# EasyEDA Pro project PowerManager.eprj

# Schematic Schematic1
Create Date: 2024-06-30; Page Name: P1; Project Name: PowerManager; Schematic Name: Schematic1; Update Date: 2024-07-01; Company: 嘉立创EDA; Page Size: A4; Version: V1.0
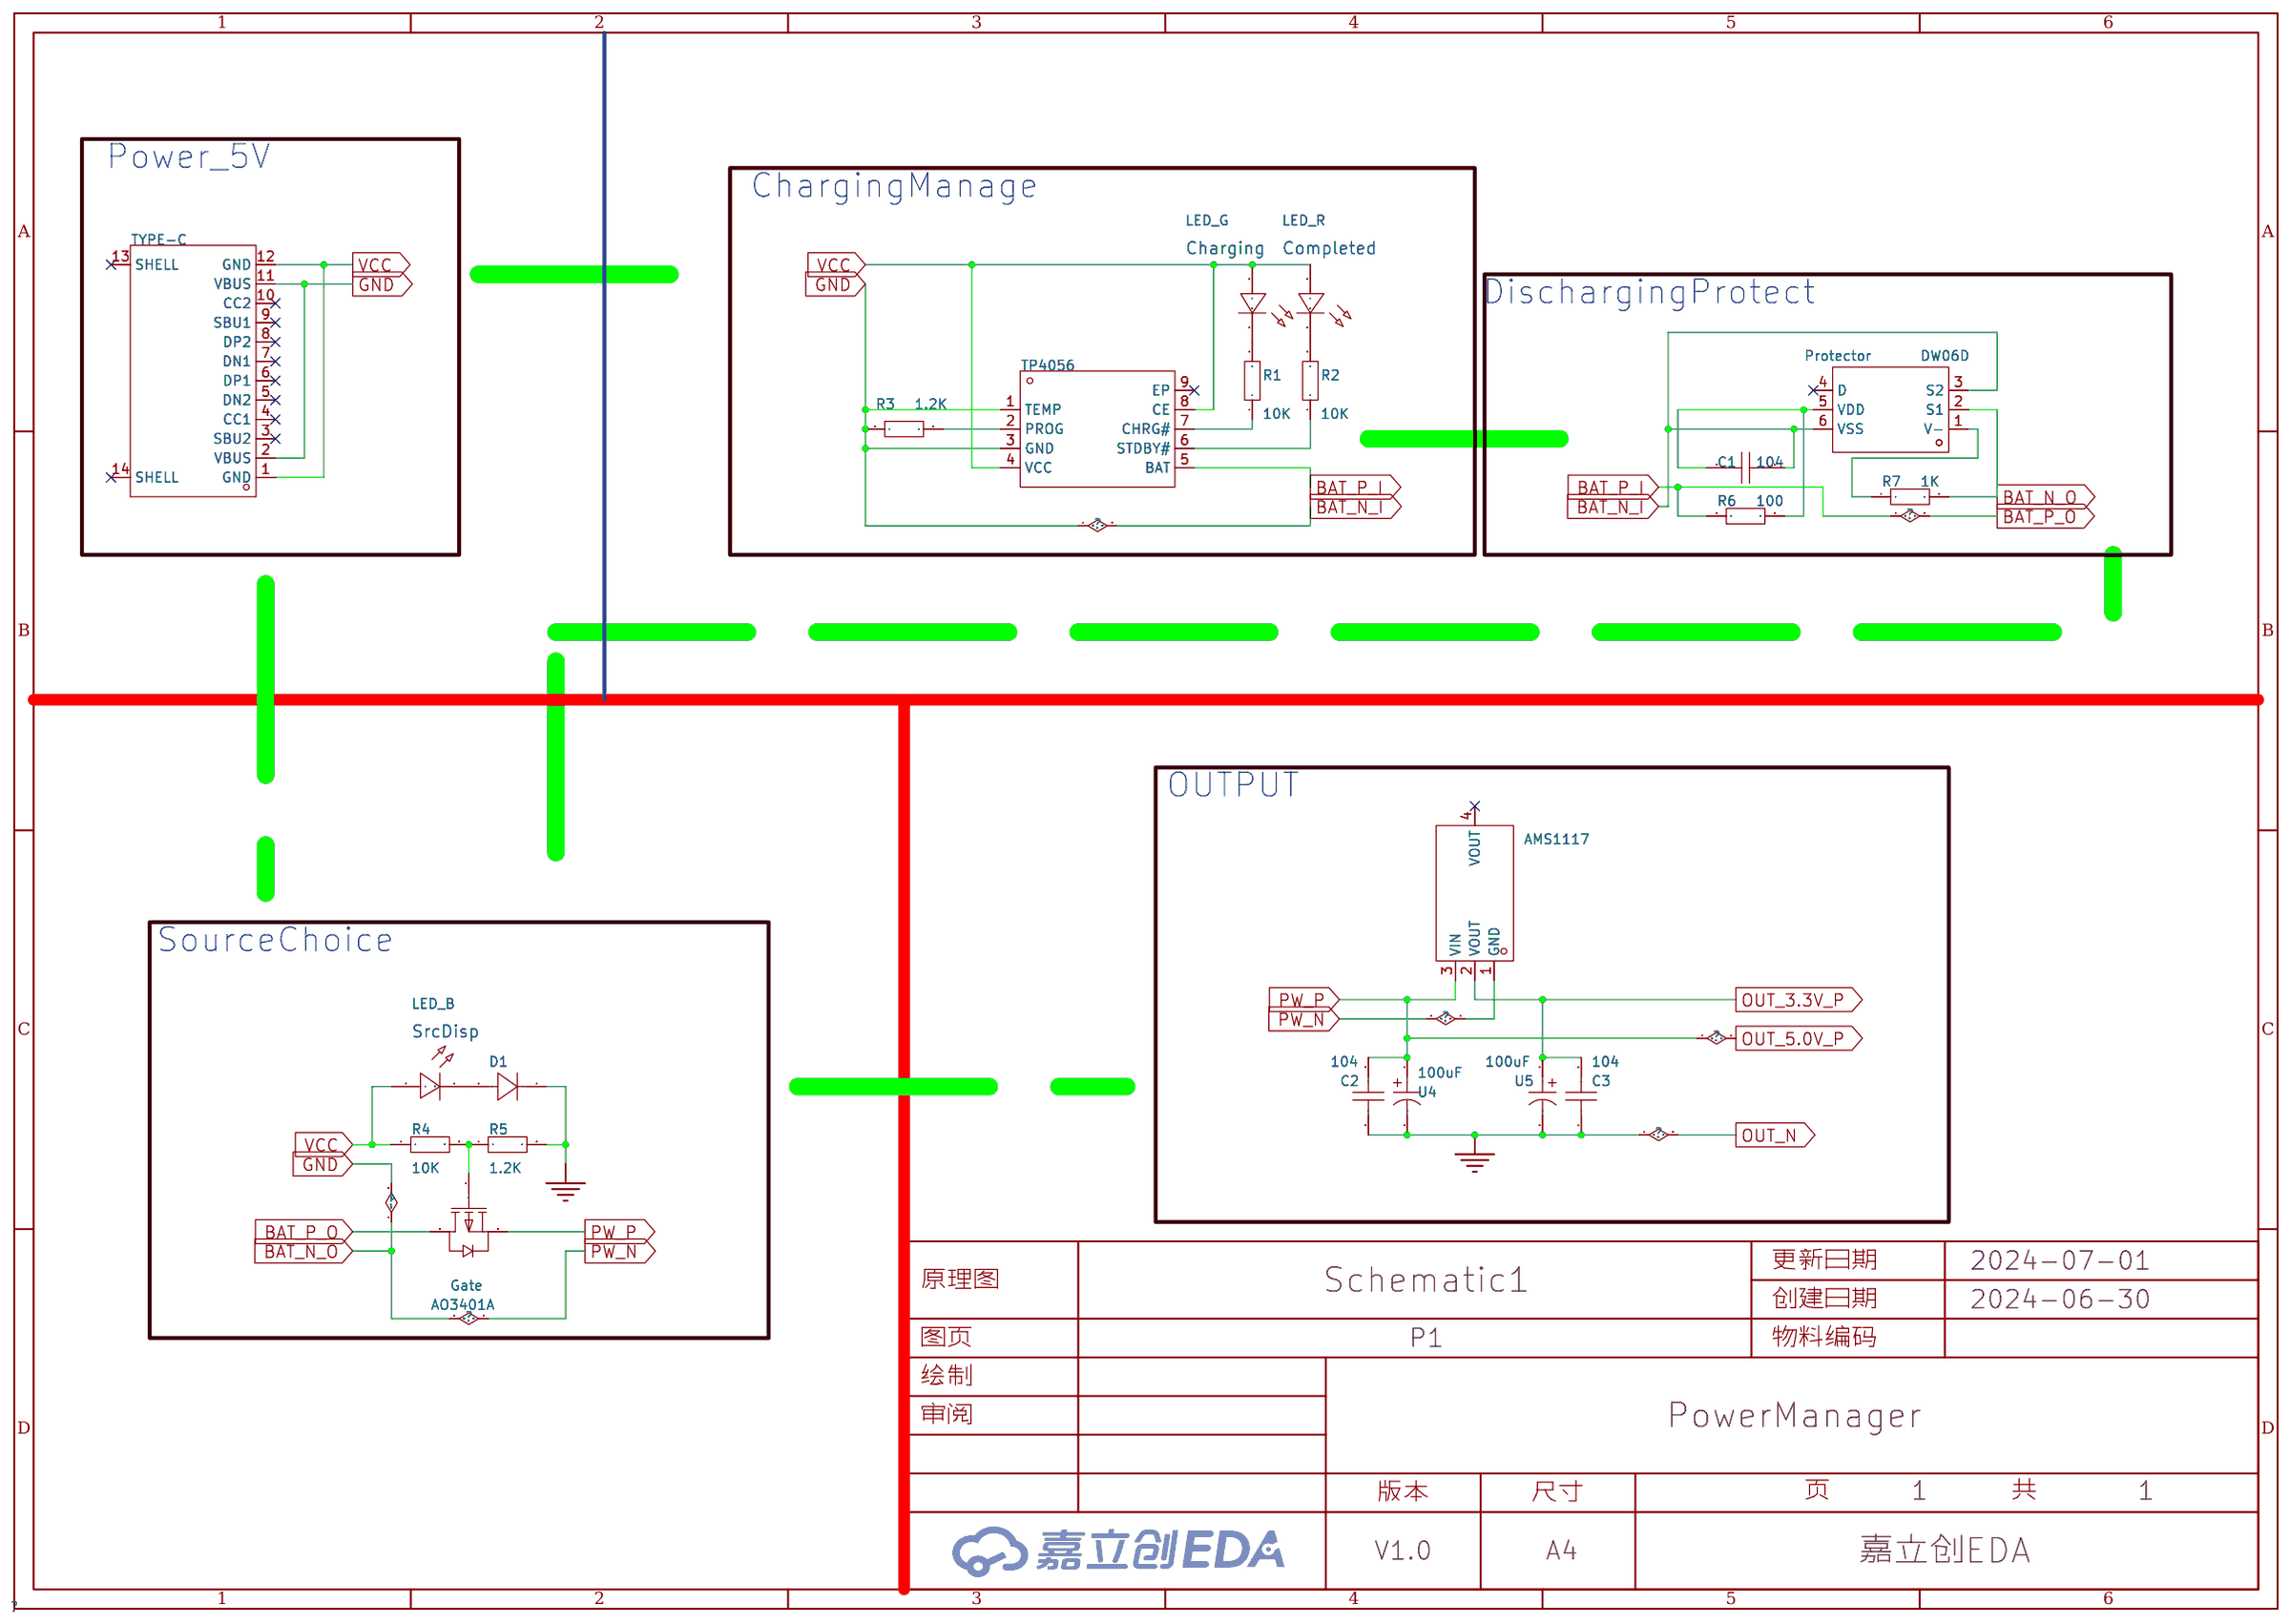
[diagram p0: schematic sheet]

## Parts
C1  104  [C0603]
C2  104  [C0603]
C3  104  [C0603]
Charging  LED_G  [LED_0603]
Completed  LED_R  [LED_0603]
D1  -  [SMA_1N4007]
Gate  AO3401A  [SOT-23_L2.9-W1.3-P1.90-LS2.4-BR]
Protector  DW06D  [SOT-23-6_L2.9-W1.6-P0.95-LS2.8-BR]
R1  10K  [R0603]
R2  10K  [R0603]
R3  1.2K  [R0603]
R4  10K  [R0603]
R5  1.2K  [R0603]
R6  100  [R0603]
R7  1K  [R0603]
SrcDisp  LED_B  [LED_0603]
Type-C  TYPE-C  [USB-C-SMD_TYPE-C-6PIN-2MD-073]
U1  TP4056  [ESOP-8_L4.9-W3.9-P1.27-LS6.0-BL-EP]
U3  AMS1117  [SOT-223-3_L6.5-W3.4-P2.30-LS7.0-BR]
U4  100uF  [CAP-SMD_L7.3-W4.3-L-FD_EEFSX0E471E4]
U5  100uF  [CAP-SMD_L7.3-W4.3-L-FD_EEFSX0E471E4]

## Library data of the parts
C1-C3 = CAP_0603: Supplier Footprint: 0603
Charging Completed SrcDisp = LED_0603-R: Supplier Footprint: 0603
D1 = D_1N4007: Supplier Footprint: SMA
Gate = AO3401A_C15127: 类型:1个P沟道;漏源电压(Vdss):30V;连续漏极电流(Id):4A;功率(Pd):1.4W;导通电阻(RDS(on)@Vgs,Id):44mΩ@10V,4.3A;阈值电压(Vgs(th)@Id):1.3V@250uA;; LCSC Part Name: 1个P沟道 耐压:30V 电流:4A; Supplier Part: C15127; Manufacturer: AOS; Supplier Footprint: SOT-23; Datasheet: https://atta.szlcsc.com/upload/public/pdf/source/20160507/1462613609053.pdf; Supplier: LCSC; Type: 1个P沟道; Drain Source Voltage (Vdss): 30V; Continuous Drain Current (Id): 4A; Power Dissipation (Pd): 1.4W; Drain Source On Resistance (RDS(on)@Vgs,Id): 44mΩ@10V,4.3A; Gate Threshold Voltage (Vgs(th)@Id): 1.3V@250uA; Total Gate Charge (Qg@Vgs): 12.2nC@4.5V; Input Capacitance (Ciss@Vds): 1.2nF@15V; Operating Temperature: -55℃~+150℃@(Tj)
Protector = DW06D/J: 二合一锂电池保护 IC; Supplier Part: C82123; Manufacturer: FM(富满); Supplier Footprint: SOT-23-6; Datasheet: https://atta.szlcsc.com/upload/public/pdf/source/20160903/1472896624271.pdf; Supplier: LCSC
R1-R7 = Res_0603: Supplier Footprint: 0603
Type-C = TYPE-C 16PIN 2MD(073): 连接器类型:Type-C;标准:-;公母:母;端口数量:1;触点数量:16P;安装方式:卧贴;额定电流 - 电源:5A;工作温度范围:-25℃~+85℃;; LCSC Part Name: Type-C 母 卧贴; Supplier Part: C2765186; Manufacturer: SHOU HAN(首韩); Supplier Footprint: SMD; Datasheet: https://atta.szlcsc.com/upload/public/pdf/source/20211123/39B17C16241EAC15C5E277BDA434118E.pdf; Supplier: LCSC; Gender: 母; Number of Ports: 1; Number of Contacts: 16P; Mounting Style: 卧贴; Current Rating - Power (Max): 5A; Operating Temperature Range: -25℃~+85℃
U1 = TP4056_C725790: Supplier Part: C725790; Manufacturer: UMW(友台半导体); Supplier Footprint: ESOP-8; Datasheet: https://atta.szlcsc.com/upload/public/pdf/source/20231109/CF74897CE79A500F7FE27A45ADCCC631.pdf; Supplier: LCSC
U3 = AMS1117-3.3_C6186: 输出类型:固定;最大输入电压:-;输出电压:3.3V;最大输出电流:1A;电源纹波抑制比(PSRR):72dB@(120Hz);输出极性:正极;; LCSC Part Name: 输出3.3V 1A; Supplier Part: C6186; Manufacturer: AMS; Supplier Footprint: SOT-223; Datasheet: https://atta.szlcsc.com/upload/public/pdf/source/20180727/C6186_7A095716F0823C02F1997A905E26C086.pdf; Supplier: LCSC; Output Type: 固定; Output Voltage: 3.3V; MAX Output Current: 1A; Power Supply Rejection Ratio (PSRR): 72dB@(120Hz); Dropout Voltage: 1.3V@(800mA); Output Polarity: 正极; Number of Outputs: 1
U4 U5 = TR3D107K016C0150: 容值:100uF;精度:±10%;额定电压:16V;等效串联电阻:150mΩ;; LCSC Part Name: 100uF ±10% 16V; Supplier Part: C1953348; Manufacturer: VISHAY(威世); Supplier Footprint: CASE-D-7343-31(mm); Datasheet: https://atta.szlcsc.com/upload/public/pdf/source/20210424/D2589FD6E35F2EE55A4FE29C9A2BF604.pdf; Supplier: LCSC; Tolerance: ±10%; Rated Voltage: 16V; Equivalent Series Resistance(ESR): 150mΩ; Operating Temperature: -55℃~+125℃

## Nets
GND: C1.1 C2.1 C3.1 D1.1(K) Protector.2(S1) Protector.3(S2) Protector.6(VSS) R3.1 R5.2 R7.2 Type-C.2(VBUS) Type-C.11(VBUS) U1.1(TEMP) U1.3(GND) U3.1(GND) U4.2 U5.2
VCC: Charging.2(A) Completed.2(A) R4.1 SrcDisp.2(A) Type-C.1(GND) Type-C.12(GND) U1.4(VCC) U1.8(CE)
BAT_P_I: Gate.3(D) R6.1 U1.5(BAT)
OUT_3.3V_P: C3.2 U3.2(VOUT) U5.1
OUT_5.0V_P: C2.2 Gate.2(S) U3.3(VIN) U4.1
$1N897: Completed.1(C) R2.2
$1N964: Charging.1(C) R1.2
$1N1874: Gate.1(G) R4.2 R5.1
$1N6420: D1.2(A) SrcDisp.1(C)
Net-(C1-2): C1.2 Protector.5(VDD) R6.2
Net-(Protector-1): Protector.1(V-) R7.1
Net-(R1-1): R1.1 U1.7(CHRG#)
Net-(R2-1): R2.1 U1.6(STDBY#)
Net-(R3-2): R3.2 U1.2(PROG)

Not connected (* = marked no-connect by the designer): Protector 4(D)*; Type-C 3(SBU2)* 4(CC1)* 5(DN2)* 6(DP1)* 7(DN1)* 8(DP2)* 9(SBU1)* 10(CC2)* 13(SHELL)* 14(SHELL)*; U1 9(EP)*; U3 4(VOUT)*

## Notes on the sheet
- Power_5V
- ChargingManage
- DischargingProtect
- OUTPUT
- SourceChoice

# Board PCB1
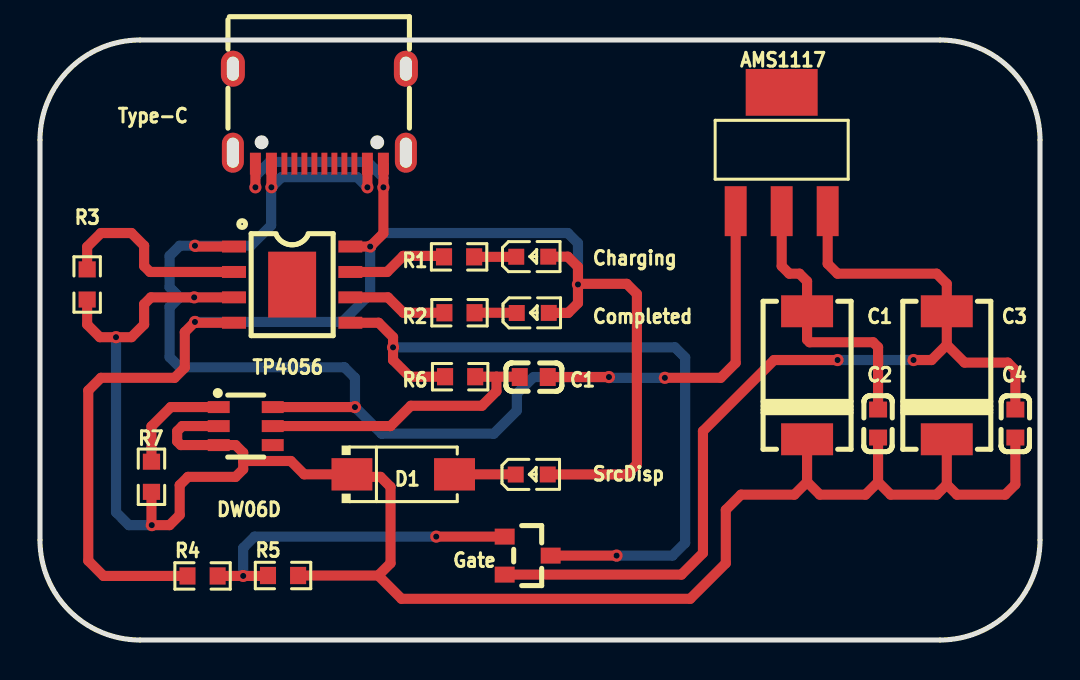
[diagram p1: board, top side]
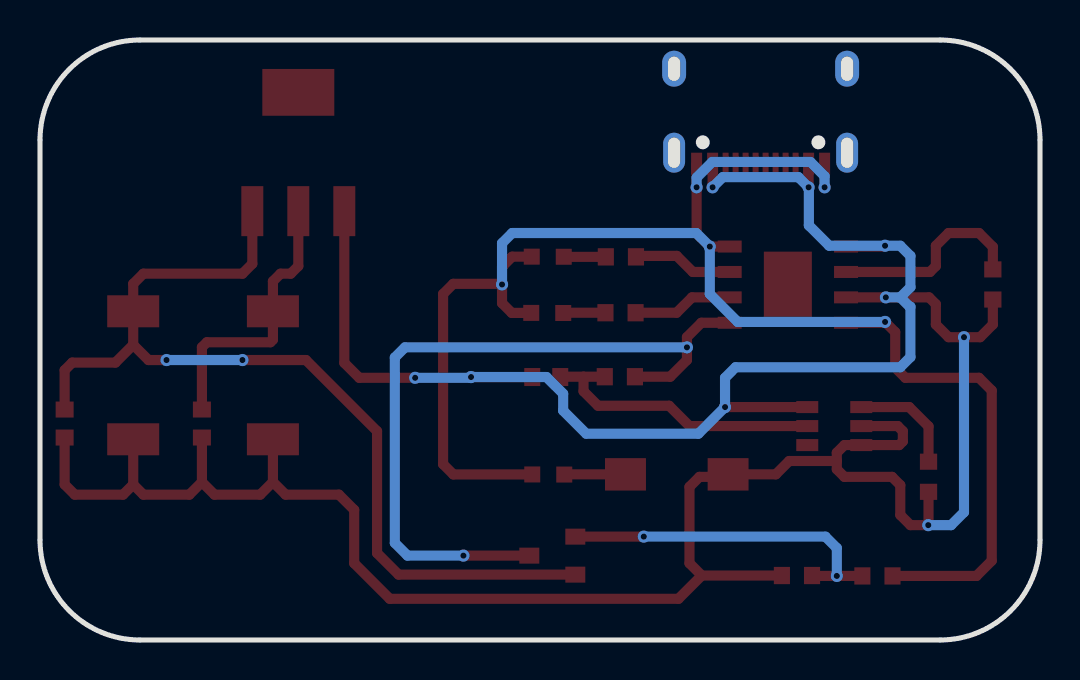
[diagram p2: board, bottom side, seen from below]

Outline 50 x 30 mm; copper layers: Top Layer, Bottom Layer. Coordinates in mm from the lower left corner of the outline.
Outline path: 0,25 0,5 arc(1.46,1.46) 5,0 45,0 arc(48.54,1.46) 50,5 50,25 arc(48.54,28.54) 45,30 5,30 arc(1.46,28.54) 0,25
Stack: Top Layer 0.035mm / Dielectric1 1.51mm FR4 er 4.5 / Bottom Layer 0.035mm

## Design rules (mm)
template: JLCPCB Capability(Two Layers Board)
spacing copperThickness1oz (default): track to track 0.102, other pairs 0.152 to 0.3
spacing copperThickness2oz: track to track 0.203, other pairs 0.152 to 0.3
track width copperThickness1oz (default): min 0.127, default 0.254, max 2.54
track width copperThickness2oz: min 0.203, default 0.254, max 2.54
differential pair differentialPair (default): width min 0.127, default 0.254, max 2.54; gap min 0.152, default 0.152
via viaSize (default): diameter min 0.5, default 0.61, max 10; hole min 0.3, default 0.305, max 6.3

## Placement (name value [footprint] x y rotation side)
AMS1117  AMS1117  [SOT-223-3_L6.5-W3.4-P2.30-LS7.0-BR]  37.08 24.41 270 top
C1  104  [C0603]  24.69 13.15 180 top
C1#2  -  [CAP-SMD_L7.3-W4.3-L-FD_EEFSX0E471E4]  38.35 13.24 270 top
C2  104  [C0603]  41.9 10.82 90 top
C3  104  [CAP-SMD_L7.3-W4.3-L-FD_EEFSX0E471E4]  45.34 13.24 270 top
C4  104  [C0603]  48.77 10.82 90 top
Charging  LED_G  [LED_0603]  24.66 19.17 0 top
Completed  LED_R  [LED_0603]  24.69 16.36 0 top
D1  -  [SMA_1N4007]  18.16 8.28 0 top
DW06D  DW06D  [SOT-23-6_L2.9-W1.6-P0.95-LS2.8-BR]  10.29 10.7 180 top
Gate  AO3401A  [SOT-23_L2.9-W1.3-P1.90-LS2.4-BR]  24.38 4.22 180 top
R1  10K  [R0603]  20.96 19.16 0 top
R2  10K  [R0603]  20.97 16.36 0 top
R3  1.2K  [R0603]  2.36 17.78 90 top
R4  10K  [R0603]  8.13 3.2 0 top
R5  1.2K  [R0603]  12.15 3.22 0 top
R6  100  [R0603]  21.01 13.16 0 top
R7  1K  [R0603]  5.57 8.16 270 top
SrcDisp  LED_B  [LED_0603]  24.64 8.28 0 top
TP4056  TP4056  [ESOP-8_L4.9-W3.9-P1.27-LS6.0-BL-EP]  12.61 17.77 270 top
Type-C  TYPE-C  [USB-C-SMD_TYPE-C-6PIN-2MD-073]  13.97 26.19 180 top

## Footprints (pads in the part's own frame, mm; a bottom-side part is the same pattern mirrored in y, then rotated)
C0603
  rect 0.8x0.9 smd: 1(-0.7,0) 2(0.7,0)
CAP-SMD_L7.3-W4.3-L-FD_EEFSX0E471E4
  rect 1.6x2.6 smd: 1(-3.2,0) 2(3.2,0)
ESOP-8_L4.9-W3.9-P1.27-LS6.0-BL-EP
  rect 0.6x1.2 smd: 1(-1.905,-2.909) 2(-0.635,-2.909) 3(0.635,-2.909) 4(1.905,-2.909) 5(1.905,2.909) 6(0.635,2.909) 7(-0.635,2.909) 8(-1.905,2.909)
  rect 3.3x2.4 smd: 9(0,0)
LED_0603
  rect 0.8x0.8 smd: 1(-0.851,-0.01) 2(0.75,-0.005)
R0603
  rect 0.806x0.864 smd: 1(-0.753,0) 2(0.753,0)
SMA_1N4007
  rect 2.046x1.62 smd: 1(-2.566,0) 2(2.566,0)
SOT-23-6_L2.9-W1.6-P0.95-LS2.8-BR
  rect 1.1x0.6 smd: 1(1.35,-0.95) 2(1.35,0) 3(1.35,0.95) 4(-1.35,0.95) 5(-1.35,0) 6(-1.35,-0.95)
SOT-23_L2.9-W1.3-P1.90-LS2.4-BR
  rect 1x0.8 smd: 1(1.15,-0.95) 2(1.15,0.95) 3(-1.15,0)
SOT-223-3_L6.5-W3.4-P2.30-LS7.0-BR
  rect 2.5x1.1 smd: 1(2.97,-2.3) 2(2.97,0) 3(2.97,2.3)
  rect 2.34x3.6 smd: 4(-2.97,0)
USB-C-SMD_TYPE-C-6PIN-2MD-073
  rect 0.55x1.1 smd: 1(-3.2,2.375) 2(-2.4,2.375) 11(2.4,2.375) 12(3.2,2.375)
  rect 0.3x1.1 smd: 3(-1.75,2.375) 4(-1.25,2.375) 5(-0.75,2.375) 6(-0.25,2.375) 7(0.25,2.375) 8(0.75,2.375) 9(1.25,2.375) 10(1.75,2.375)
  oval 1.1x2 hole 0.6x1.5: 13(-4.325,1.825) 14(4.325,1.825)
  oval 1.2x1.8 hole 0.6x1.2: 13(-4.325,-2.375) 14(4.325,-2.375)

## Nets
GND: AMS1117.1 C1.1 C1#2.2 C2.1 C3.2 C4.1 D1.1 DW06D.2 DW06D.3 DW06D.6 R3.1 R5.2 R7.2 TP4056.1 TP4056.3 Type-C.2 Type-C.11
VCC: Charging.2 Completed.2 R4.1 SrcDisp.2 TP4056.4 TP4056.8 Type-C.1 Type-C.12
BAT_P_I: Gate.3 R6.1 TP4056.5
OUT_3.3V_P: AMS1117.2 C1#2.1 C2.2
OUT_5.0V_P: AMS1117.3 C3.1 C4.2 Gate.2
$1N753: R3.2 TP4056.2
$1N897: Completed.1 R2.2
$1N964: Charging.1 R1.2
$1N968: R1.1 TP4056.7
$1N975: R2.1 TP4056.6
$1N1874: Gate.1 R4.2 R5.1
$1N2995: DW06D.1 R7.1
$1N3321: C1.2 DW06D.5 R6.2
$1N6420: D1.2 SrcDisp.1

Pads without a net: AMS1117 4; DW06D 4; TP4056 9; Type-C 3 4 5 6 7 8 9 10 13 14

## Via types
v1: diameter 0.61, hole 0.305, Top Layer to Bottom Layer, 20 vias

## Routing (per net, layer and track width the routed paths; a pad name or vN(x,y) marks a point on that pad's centre or on a via; arc(x,y) is an arc through that point)
GND: length 170.5
  Top Layer w0.508: DW06D.2 7.11,10.7 6.86,10.44 6.86,9.93 7.04,9.75 DW06D.3 9.78,9.75 10.16,9.36 10.16,8.95 ; AMS1117.1 34.78,13.86 34.04,13.11 v1(31.24,13.11) ; 38.35,7.9 38.99,7.27 41.28,7.27 41.9,7.9 ; 38.35,7.9 37.72,7.27 35.05,7.27 34.29,6.5 34.29,3.84 32.51,2.06 18.08,2.06 16.91,3.22 ; 38.35,7.9 C1#2.2 ; v1(15.75,11.65) DW06D.6 ; 9.7,17.13 v1(7.71,17.13) 5.55,17.13 5.21,16.79 5.21,15.78 4.57,15.14 v1(3.8,15.14) 2.99,15.14 2.36,15.78 2.36,16.9 ; 45.34,7.78 44.83,7.27 42.53,7.27 41.9,7.9 ; 45.34,7.78 45.85,7.27 48.26,7.27 48.77,7.78 48.77,10.12 ; 45.34,7.78 C3.2 ; 16.91,3.22 R5.2 ; 16.91,3.22 17.53,3.84 17.53,7.66 17.03,8.16 15.72,8.16 D1.1 13.21,8.28 12.54,8.95 10.16,8.95 ; C1.1 v1(28.45,13.15) ; Type-C.2 v1(16.37,22.63) ; 9.7,19.67 7.79,19.67 v1(7.75,19.71) ; 10.16,8.95 10.16,8.54 9.78,8.16 7.4,8.16 6.98,7.74 6.98,6.25 6.48,5.74 v1(5.59,5.74) 5.57,5.76 R7.2 ; 41.9,7.9 C2.1 ; Type-C.11 v1(11.57,22.63)
  Bottom Layer w0.508: 6.98,17.13 6.52,16.67 6.48,16.67 6.48,14.14 6.98,13.64 15.22,13.64 15.75,13.11 v1(15.75,11.65) 17.08,10.31 22.69,10.31 23.84,11.47 23.84,12.31 24.68,13.15 v1(28.45,13.15) 28.49,13.11 v1(31.24,13.11) ; 6.98,17.13 v1(7.71,17.13) ; 6.98,17.13 6.48,17.64 6.48,19.2 6.98,19.71 v1(7.75,19.71) 10.54,19.71 11.56,20.73 11.56,22.62 v1(11.57,22.63) 12.08,23.14 15.86,23.14 v1(16.37,22.63) ; v1(3.8,15.14) 3.8,6.39 4.44,5.74 v1(5.59,5.74)
VCC: length 84.4
  Top Layer w0.508: Charging.2 26.39,19.17 26.9,18.66 v1(26.9,17.78) ; v1(26.9,17.78) 26.9,16.84 26.41,16.36 Completed.2 ; v1(26.9,17.78) 26.93,17.81 29.34,17.81 29.84,17.3 29.84,8.79 29.33,8.28 SrcDisp.2 ; Type-C.1 v1(17.17,22.63) 17.17,20.33 v1(16.51,19.67) TP4056.8 ; Type-C.12 v1(10.77,22.63) ; R4.1 3.17,3.2 2.41,3.97 2.41,12.47 3.05,13.11 6.73,13.11 7.24,13.62 7.24,15.39 v1(7.75,15.9) 7.79,15.86 9.7,15.86
  Bottom Layer w0.508: v1(17.17,22.63) 17.17,23.12 16.38,23.9 11.48,23.9 10.77,23.19 v1(10.77,22.63) ; v1(7.75,15.9) 15.11,15.9 16.51,17.3 v1(16.51,19.67) 17.19,20.35 26.39,20.35 26.9,19.84 v1(26.9,17.78)
BAT_P_I: length 37.6
  Top Layer w0.508: v1(28.83,4.22) Gate.3 ; TP4056.5 16.93,15.86 17.65,15.14 v1(17.65,14.63) 17.65,14 18.49,13.16 R6.1
  Bottom Layer w0.508: v1(17.65,14.63) 31.75,14.63 32.26,14.12 32.26,4.85 31.62,4.22 v1(28.83,4.22)
OUT_3.3V_P: length 14.1
  Top Layer w0.508: C2.2 41.9,14.64 41.66,14.89 38.48,14.89 38.35,15.01 C1#2.1 38.35,17.94 37.97,18.32 37.47,18.32 37.08,18.7 AMS1117.2
OUT_5.0V_P: length 48.4
  Top Layer w0.508: 45.34,14.76 C3.1 45.34,17.81 44.83,18.32 39.88,18.32 39.38,18.81 AMS1117.3 ; 45.34,14.76 46.23,13.87 48.39,13.87 48.77,13.49 C4.2 ; 45.34,14.76 44.58,14 v1(43.67,14) ; v1(39.88,14) 36.7,14 33.15,10.44 33.15,4.35 32.07,3.27 Gate.2
  Bottom Layer w0.508: v1(39.88,14) v1(43.67,14)
$1N753: length 10.3
  Top Layer w0.508: 9.7,18.4 5.5,18.4 5.21,18.7 5.21,19.71 4.57,20.35 3.05,20.35 2.36,19.66 2.36,18.4
$1N897: length 2.1
  Top Layer w0.508: Completed.1 23.82,16.36 R2.2
$1N964: length 2.1
  Top Layer w0.508: R1.2 23.81,19.16 Charging.1
$1N968: length 5
  Top Layer w0.508: R1.1 20.15,19.2 18.16,19.2 17.36,18.4 TP4056.7
$1N975: length 5
  Top Layer w0.508: R2.1 18.17,16.36 17.4,17.13 TP4056.6
$1N1874: length 17.2
  Top Layer w0.508: R5.1 11.38,3.2 v1(10.16,3.2) R4.2 ; Gate.1 v1(19.81,5.17)
  Bottom Layer w0.508: v1(10.16,3.2) 10.16,4.6 10.73,5.17 v1(19.81,5.17)
$1N2995: length 5.5
  Top Layer w0.508: R7.1 5.57,10.68 6.54,11.65 DW06D.1
$1N3321: length 14.9
  Top Layer w0.508: C1.2 23.97,13.16 22.82,13.16 ; 22.82,13.16 R6.2 ; 22.82,13.16 22.82,12.44 22.1,11.71 18.54,11.71 17.53,10.7 DW06D.5
$1N6420: length 3.1
  Top Layer w0.508: D1.2 23.78,8.28 SrcDisp.1
